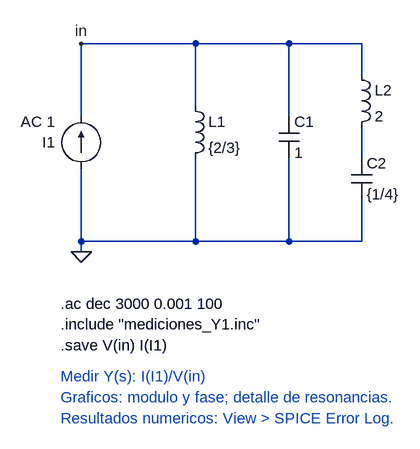
[diagram p0: schematic ejercicio1b.asc]
ejercicio1b.asc, the LTspice schematic file:
Version 4.1
SHEET 1 1000 760
WIRE 192 -16 16 -16
WIRE 336 -16 192 -16
WIRE 448 -16 336 -16
WIRE 448 32 448 -16
WIRE 192 80 192 -16
WIRE 16 96 16 -16
WIRE 336 96 336 -16
WIRE 448 160 448 112
WIRE 16 288 16 176
WIRE 192 288 192 160
WIRE 192 288 16 288
WIRE 336 288 336 160
WIRE 336 288 192 288
WIRE 448 288 448 224
WIRE 448 288 336 288
WIRE 16 304 16 288
FLAG 16 304 0
SYMBOL current 16 176 R180
WINDOW 0 40 40 Left 2
WINDOW 3 40 72 Left 2
SYMATTR InstName I1
SYMATTR Value AC 1
SYMBOL ind 176 64 R0
SYMATTR InstName L1
SYMATTR Value {2/3}
SYMATTR SpiceLine Rser=0 Rpar=1e30
SYMBOL ind 432 16 R0
SYMATTR InstName L2
SYMATTR Value 2
SYMATTR SpiceLine Rser=0 Rpar=1e30
SYMBOL cap 320 96 R0
SYMATTR InstName C1
SYMATTR Value 1
SYMBOL cap 432 160 R0
SYMATTR InstName C2
SYMATTR Value {1/4}
FLAG 16 -16 in
TEXT -16 384 Left 2 !.ac dec 3000 0.001 100
TEXT -16 416 Left 2 !.include "mediciones_Y1.inc"
TEXT -16 448 Left 2 !.save V(in) I(I1)
TEXT -16 496 Left 2 ;Medir Y(s): I(I1)/V(in)
TEXT -16 528 Left 2 ;Graficos: modulo y fase; detalle de resonancias.
TEXT -16 560 Left 2 ;Resultados numericos: View > SPICE Error Log.

The netlist it stands for:
* ejercicio1b.asc
I1 0 in AC 1
L1 in 0 {2/3} Rser=0 Rpar=1e30
L2 in N001 2 Rser=0 Rpar=1e30
C1 in 0 1
C2 N001 0 {1/4}
.ac dec 3000 0.001 100
.include "mediciones_Y1.inc"
.save V(in) I(I1)
* Medir Y(s): I(I1)/V(in)
* Graficos: modulo y fase; detalle de resonancias.
* Resultados numericos: View > SPICE Error Log.
.backanno
.end